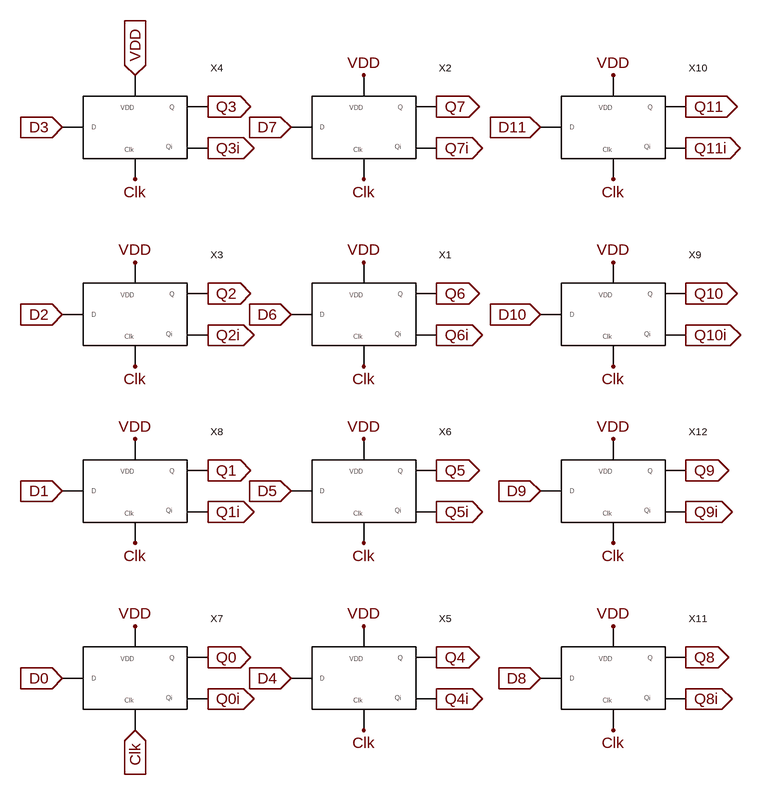
[diagram p0: schematic 12_bit_register_NOT.asc]
12_bit_register_NOT.asc, the LTspice schematic file:
Version 4
SHEET 1 880 932
FLAG 160 112 VDD
FLAG 160 272 Clk
FLAG 48 192 D6
IOPIN 48 192 In
FLAG 272 160 Q6
IOPIN 272 160 Out
FLAG 272 224 Q6i
IOPIN 272 224 Out
FLAG 160 -176 VDD
FLAG 160 -16 Clk
FLAG 48 -96 D7
IOPIN 48 -96 In
FLAG 272 -128 Q7
IOPIN 272 -128 Out
FLAG 272 -64 Q7i
IOPIN 272 -64 Out
FLAG -192 112 VDD
FLAG -192 272 Clk
FLAG -304 192 D2
IOPIN -304 192 In
FLAG -80 160 Q2
IOPIN -80 160 Out
FLAG -80 224 Q2i
IOPIN -80 224 Out
FLAG -192 -176 VDD
IOPIN -192 -176 In
FLAG -192 -16 Clk
FLAG -304 -96 D3
IOPIN -304 -96 In
FLAG -80 -128 Q3
IOPIN -80 -128 Out
FLAG -80 -64 Q3i
IOPIN -80 -64 Out
FLAG 160 672 VDD
FLAG 160 832 Clk
FLAG 48 752 D4
IOPIN 48 752 In
FLAG 272 720 Q4
IOPIN 272 720 Out
FLAG 272 784 Q4i
IOPIN 272 784 Out
FLAG 160 384 VDD
FLAG 160 544 Clk
FLAG 48 464 D5
IOPIN 48 464 In
FLAG 272 432 Q5
IOPIN 272 432 Out
FLAG 272 496 Q5i
IOPIN 272 496 Out
FLAG -192 672 VDD
FLAG -192 832 Clk
IOPIN -192 832 In
FLAG -304 752 D0
IOPIN -304 752 In
FLAG -80 720 Q0
IOPIN -80 720 Out
FLAG -80 784 Q0i
IOPIN -80 784 Out
FLAG -192 384 VDD
FLAG -192 544 Clk
FLAG -304 464 D1
IOPIN -304 464 In
FLAG -80 432 Q1
IOPIN -80 432 Out
FLAG -80 496 Q1i
IOPIN -80 496 Out
FLAG 544 112 VDD
FLAG 544 272 Clk
FLAG 432 192 D10
IOPIN 432 192 In
FLAG 656 160 Q10
IOPIN 656 160 Out
FLAG 656 224 Q10i
IOPIN 656 224 Out
FLAG 544 -176 VDD
FLAG 544 -16 Clk
FLAG 432 -96 D11
IOPIN 432 -96 In
FLAG 656 -128 Q11
IOPIN 656 -128 Out
FLAG 656 -64 Q11i
IOPIN 656 -64 Out
FLAG 544 672 VDD
FLAG 544 832 Clk
FLAG 432 752 D8
IOPIN 432 752 In
FLAG 656 720 Q8
IOPIN 656 720 Out
FLAG 656 784 Q8i
IOPIN 656 784 Out
FLAG 544 384 VDD
FLAG 544 544 Clk
FLAG 432 464 D9
IOPIN 432 464 In
FLAG 656 432 Q9
IOPIN 656 432 Out
FLAG 656 496 Q9i
IOPIN 656 496 Out
SYMBOL DFF 80 240 R0
SYMATTR InstName X1
SYMBOL DFF 80 -48 R0
SYMATTR InstName X2
SYMBOL DFF -272 240 R0
SYMATTR InstName X3
SYMBOL DFF -272 -48 R0
SYMATTR InstName X4
SYMBOL DFF 80 800 R0
SYMATTR InstName X5
SYMBOL DFF 80 512 R0
SYMATTR InstName X6
SYMBOL DFF -272 800 R0
SYMATTR InstName X7
SYMBOL DFF -272 512 R0
SYMATTR InstName X8
SYMBOL DFF 464 240 R0
SYMATTR InstName X9
SYMBOL DFF 464 -48 R0
SYMATTR InstName X10
SYMBOL DFF 464 800 R0
SYMATTR InstName X11
SYMBOL DFF 464 512 R0
SYMATTR InstName X12

The netlist it stands for:
* 12_bit_register_NOT.asc
XX1 D6 Clk Q6 Q6i VDD DFF  ; pins D Clk Q Qi VDD
XX2 D7 Clk Q7 Q7i VDD DFF  ; pins D Clk Q Qi VDD
XX3 D2 Clk Q2 Q2i VDD DFF  ; pins D Clk Q Qi VDD
XX4 D3 Clk Q3 Q3i VDD DFF  ; pins D Clk Q Qi VDD
XX5 D4 Clk Q4 Q4i VDD DFF  ; pins D Clk Q Qi VDD
XX6 D5 Clk Q5 Q5i VDD DFF  ; pins D Clk Q Qi VDD
XX7 D0 Clk Q0 Q0i VDD DFF  ; pins D Clk Q Qi VDD
XX8 D1 Clk Q1 Q1i VDD DFF  ; pins D Clk Q Qi VDD
XX9 D10 Clk Q10 Q10i VDD DFF  ; pins D Clk Q Qi VDD
XX10 D11 Clk Q11 Q11i VDD DFF  ; pins D Clk Q Qi VDD
XX11 D8 Clk Q8 Q8i VDD DFF  ; pins D Clk Q Qi VDD
XX12 D9 Clk Q9 Q9i VDD DFF  ; pins D Clk Q Qi VDD
.backanno
.end